# EAGLE schematic board (EAGLE 7.7.0)
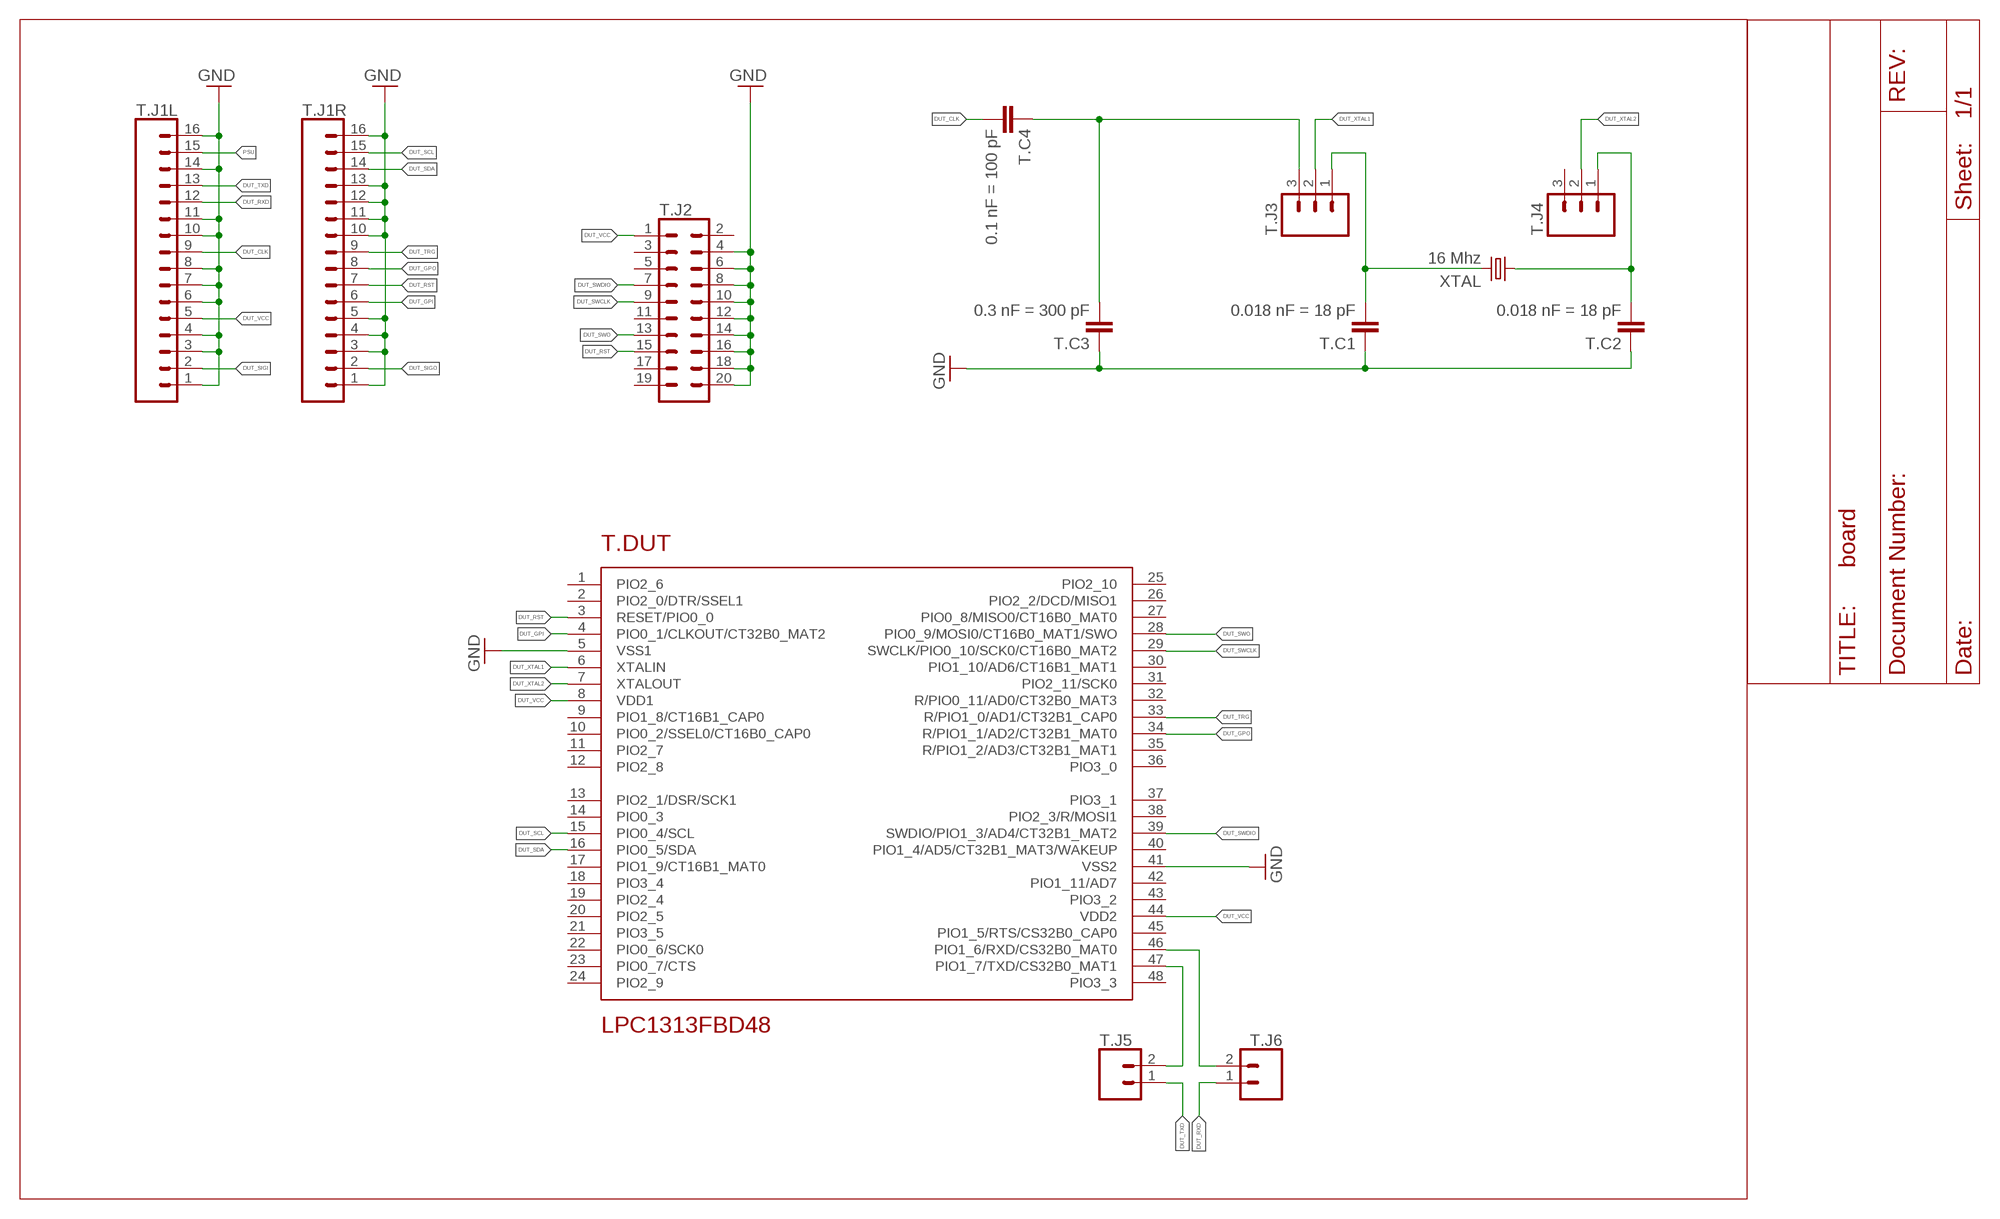
[diagram p0: schematic, sheet 1]

## Parts
T.C1  0.018 nF = 18 pF  CAP0603-CAP  [0603-CAP]
T.C2  0.018 nF = 18 pF  CAP0603-CAP  [0603-CAP]
T.C3  0.3 nF = 300 pF  CAP0603-CAP  [0603-CAP]
T.C4  0.1 nF = 100 pF  CAP0603-CAP  [0603-CAP]
T.DUT  LPC1313FBD48  [LQFP48]
T.J1L  CONN_16  [1X16]
T.J1R  CONN_16  [1X16]
T.J2  CONN_10X2  [2X10]
T.J3  M03PTH  [1X03]
T.J4  M03PTH  [1X03]
T.J5  CONN_02  [1X02]
T.J6  CONN_02  [1X02]
XTAL  16 Mhz  CRYSTALHC49US  [HC49US]

## Nets
DUT_CLK: T.C4.2 T.J1L.9
DUT_GPI: T.DUT.4(PIO0_1/CLKOUT/CT32B0_MAT2) T.J1R.6
DUT_GPO: T.DUT.34(R/PIO1_1/AD2/CT32B1_MAT0) T.J1R.8
DUT_RST: T.DUT.3(RESET/PIO0_0) T.J1R.7 T.J2.15
DUT_RXD: T.J1L.12 T.J6.1
DUT_SCL: T.DUT.15(PIO0_4/SCL) T.J1R.15
DUT_SDA: T.DUT.16(PIO0_5/SDA) T.J1R.14
DUT_SIGI: T.J1L.2
DUT_SIGO: T.J1R.2
DUT_SWCLK: T.DUT.29(SWCLK/PIO0_10/SCK0/CT16B0_MAT2) T.J2.9
DUT_SWDIO: T.DUT.39(SWDIO/PIO1_3/AD4/CT32B1_MAT2) T.J2.7
DUT_SWO: T.DUT.28(PIO0_9/MOSI0/CT16B0_MAT1/SWO) T.J2.13
DUT_TRG: T.DUT.33(R/PIO1_0/AD1/CT32B1_CAP0) T.J1R.9
DUT_TXD: T.J1L.13 T.J5.1
DUT_VCC: T.DUT.8(VDD1) T.DUT.44(VDD2) T.J1L.5 T.J2.1
DUT_XTAL1: T.DUT.6(XTALIN) T.J3.2
DUT_XTAL2: T.DUT.7(XTALOUT) T.J4.2
GND: T.C1.1 T.C2.1 T.C3.1 T.DUT.5(VSS1) T.DUT.41(VSS2) T.J1L.1 T.J1L.3 T.J1L.4 T.J1L.6 T.J1L.7 T.J1L.8 T.J1L.10 T.J1L.11 T.J1L.14 T.J1L.16 T.J1R.1 T.J1R.3 T.J1R.4 T.J1R.5 T.J1R.10 T.J1R.11 T.J1R.12 T.J1R.13 T.J1R.16 T.J2.4 T.J2.6 T.J2.8 T.J2.10 T.J2.12 T.J2.14 T.J2.16 T.J2.18 T.J2.20
N$1: T.C1.2 T.J3.1 XTAL.2
N$2: T.C2.2 T.J4.1 XTAL.1
N$3: T.DUT.47(PIO1_7/TXD/CS32B0_MAT1) T.J5.2
N$4: T.DUT.46(PIO1_6/RXD/CS32B0_MAT0) T.J6.2
N$20: T.C3.2 T.C4.1 T.J3.3
PSU: T.J1L.15
Unconnected: T.DUT.1(PIO2_6) T.DUT.2(PIO2_0/DTR/SSEL1) T.DUT.9(PIO1_8/CT16B1_CAP0) T.DUT.10(PIO0_2/SSEL0/CT16B0_CAP0) T.DUT.11(PIO2_7) T.DUT.12(PIO2_8) T.DUT.13(PIO2_1/DSR/SCK1) T.DUT.14(PIO0_3) T.DUT.17(PIO1_9/CT16B1_MAT0) T.DUT.18(PIO3_4) T.DUT.19(PIO2_4) T.DUT.20(PIO2_5) T.DUT.21(PIO3_5) T.DUT.22(PIO0_6/SCK0) T.DUT.23(PIO0_7/CTS) T.DUT.24(PIO2_9) T.DUT.25(PIO2_10) T.DUT.26(PIO2_2/DCD/MISO1) T.DUT.27(PIO0_8/MISO0/CT16B0_MAT0) T.DUT.30(PIO1_10/AD6/CT16B1_MAT1) T.DUT.31(PIO2_11/SCK0) T.DUT.32(R/PIO0_11/AD0/CT32B0_MAT3) T.DUT.35(R/PIO1_2/AD3/CT32B1_MAT1) T.DUT.36(PIO3_0) T.DUT.37(PIO3_1) T.DUT.38(PIO2_3/R/MOSI1) T.DUT.40(PIO1_4/AD5/CT32B1_MAT3/WAKEUP) T.DUT.42(PIO1_11/AD7) T.DUT.43(PIO3_2) T.DUT.45(PIO1_5/RTS/CS32B0_CAP0) T.DUT.48(PIO3_3) T.J2.2 T.J2.3 T.J2.5 T.J2.11 T.J2.17 T.J2.19 T.J4.3

## Library data of the parts
T.C1-T.C4 = SparkFun-Capacitors:CAP: Capacitor Standard 0603 ceramic capacitor, and 0.1" leaded capacitor.
T.DUT = board:LPC1313FBD48
T.J1L T.J1R = SparkFun-Connectors:CONN_16: Multi connection point. Often used as Generic Header-pin footprint for 0.1 inch spaced/style header connections On any of the 0.1 inch spaced packages, you can populate with these: Break Away Headers - Straight <https://www.sparkfun.com/products/116> (PRT-00116) Break Away Male Headers - Right Angle <https://www.sparkfun.com/products/553> (PRT-00553) Female Headers <https://www.sparkfun.com/products/115> (PRT-00115) Break Away Headers - Machine Pin <https://www.sparkfun.com/products/117> (PRT-00117) Break Away Female Headers - Swiss Machine Pin <https://www.sparkfun.com/products/743> (PRT-00743) For SCREWTERMINALS and SPRING TERMINALS visit here: Screw Terimnals on SparkFun.com <https://www.sparkfun.com/search/results?term=Screw+Terminals> (5mm/3.5mm/2.54mm spacing) This device is also useful as a general connection point to wire up your design to another part of your project. Our various solder wires solder well into these plated through hole pads. Hook-Up Wire - Assortment (Stranded, 22 AWG) <https://www.sparkfun.com/products/11375> (PRT-11375) Hook-Up Wire - Assortment (Solid Core, 22 AWG) <https://www.sparkfun.com/products/11367> (PRT-11367) View the entire wire category on our website here <https://www.sparkfun.com/categories/141> Special notes: Molex polarized connector foot print use with SKU : PRT-08231 with associated crimp pins and housings. 1MM SMD Version SKU: PRT-10208 NOTES ON THE VARIANTS LOCK and LOCK_LONGPADS... This footprint was designed to help hold the alignment of a through-hole component (i.e. 6-pin header) while soldering it into place. You may notice that each hole has been shifted either up or down by 0.005 of an inch from it's more standard position (which is a perfectly straight line). This slight alteration caused the pins (the squares in the middle) to touch the edges of the holes. Because they are alternating, it causes a "brace" to hold the component in place. 0.005 has proven to be the perfect amount of "off-center" position when using our standard breakaway headers. Although looks a little odd when you look at the bare footprint, once you have a header in there, the alteration is very hard to notice. Also,if you push a header all the way into place, it is covered up entirely on the bottom side.
T.J2 = SparkFun-Connectors:CONN_10X2: Multi connection point. Often used as Generic Header-pin footprint for 0.1 inch spaced/style header connections On any of the 0.1 inch spaced packages, you can populate with these: Break Away Headers - Straight <https://www.sparkfun.com/products/116> (PRT-00116) Break Away Male Headers - Right Angle <https://www.sparkfun.com/products/553> (PRT-00553) Female Headers <https://www.sparkfun.com/products/115> (PRT-00115) Break Away Headers - Machine Pin <https://www.sparkfun.com/products/117> (PRT-00117) Break Away Female Headers - Swiss Machine Pin <https://www.sparkfun.com/products/743> (PRT-00743) Special note about the "SPECIAL" package: This was SPECIALLY designed to be used with our Graphic LCD Backpack. Be sure you want to use this! It is not only staggered on each line of header holes, but IT IS ALSO offset of the center point of the top and bottom lines by 5 mil. This causes the headers to lock into place on the "standard" footprint on the LCD screen. The extra squares on the tdocu layer are there simply to reference other pins (if you were to actually populate a longer header than ten long - this is what we do with the backpacks).
T.J3 T.J4 = SparkFun-Connectors:M03: Header 3 Standard 3-pin 0.1" header. Use with straight break away headers (SKU : PRT-00116), right angle break away headers (PRT-00553), swiss pins (PRT-00743), machine pins (PRT-00117), and female headers (PRT-00115). Molex polarized connector foot print use with SKU : PRT-08232 with associated crimp pins and housings.
T.J5 T.J6 = SparkFun-Connectors:CONN_02: Multi connection point. Often used as Generic Header-pin footprint for 0.1 inch spaced/style header connections On any of the 0.1 inch spaced packages, you can populate with these: Break Away Headers - Straight <https://www.sparkfun.com/products/116> (PRT-00116) Break Away Male Headers - Right Angle <https://www.sparkfun.com/products/553> (PRT-00553) Female Headers <https://www.sparkfun.com/products/115> (PRT-00115) Break Away Headers - Machine Pin <https://www.sparkfun.com/products/117> (PRT-00117) Break Away Female Headers - Swiss Machine Pin <https://www.sparkfun.com/products/743> (PRT-00743) For SCREWTERMINALS and SPRING TERMINALS visit here: Screw Terimnals on SparkFun.com <https://www.sparkfun.com/search/results?term=Screw+Terminals> (5mm/3.5mm/2.54mm spacing) This device is also useful as a general connection point to wire up your design to another part of your project. Our various solder wires solder well into these plated through hole pads. Hook-Up Wire - Assortment (Stranded, 22 AWG) <https://www.sparkfun.com/products/11375> (PRT-11375) Hook-Up Wire - Assortment (Solid Core, 22 AWG) <https://www.sparkfun.com/products/11367> (PRT-11367) View the entire wire category on our website here <https://www.sparkfun.com/categories/141> Special notes: Molex polarized connector foot print use with: PRT-08233 with associated crimp pins and housings. 2.54_SCREWTERM for use with PRT-10571. 3.5mm Screw Terminal footprints for PRT-08084 5mm Screw Terminal footprints for use with PRT-08432
XTAL = SparkFun-FreqCtrl:CRYSTAL: Various standard crystals. Proven footprints.